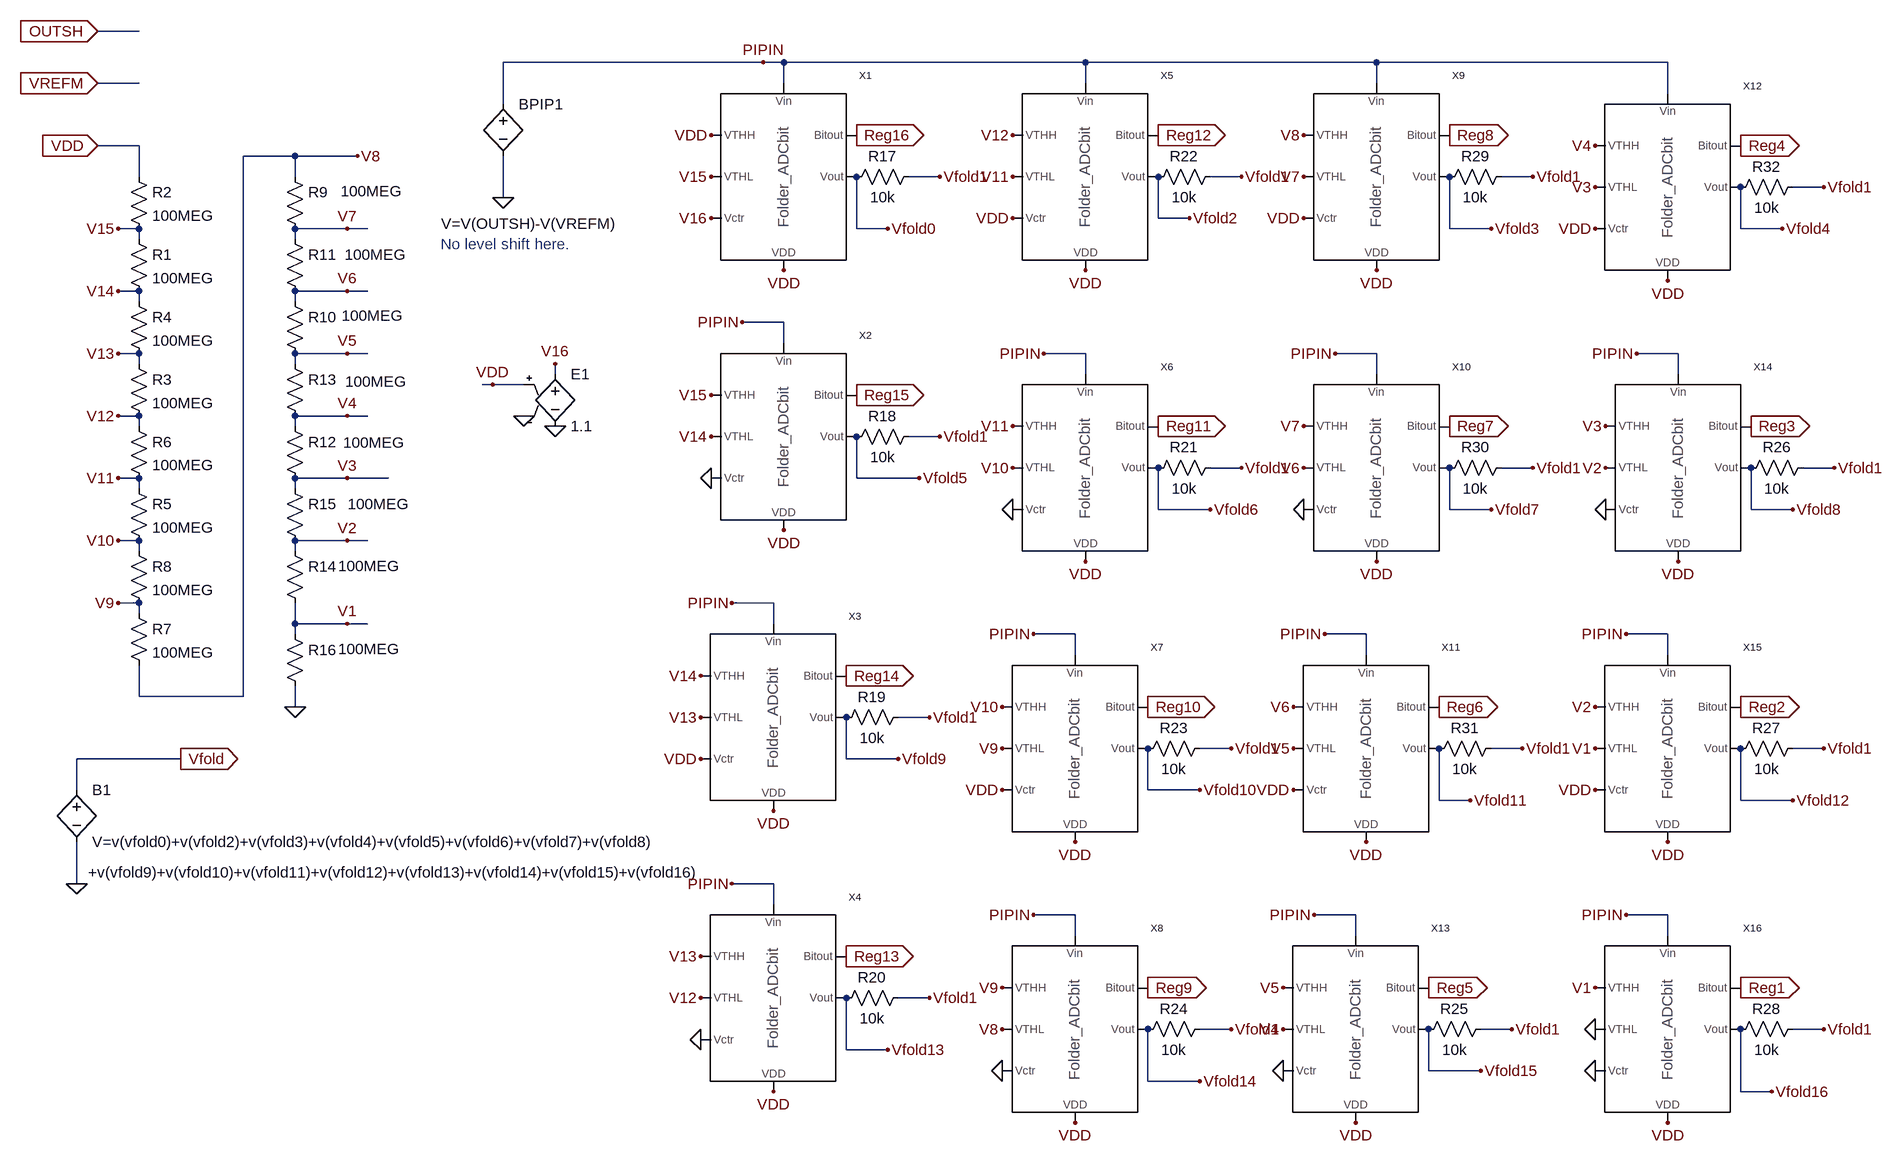
[diagram p0: schematic 4bit_folder.asc]
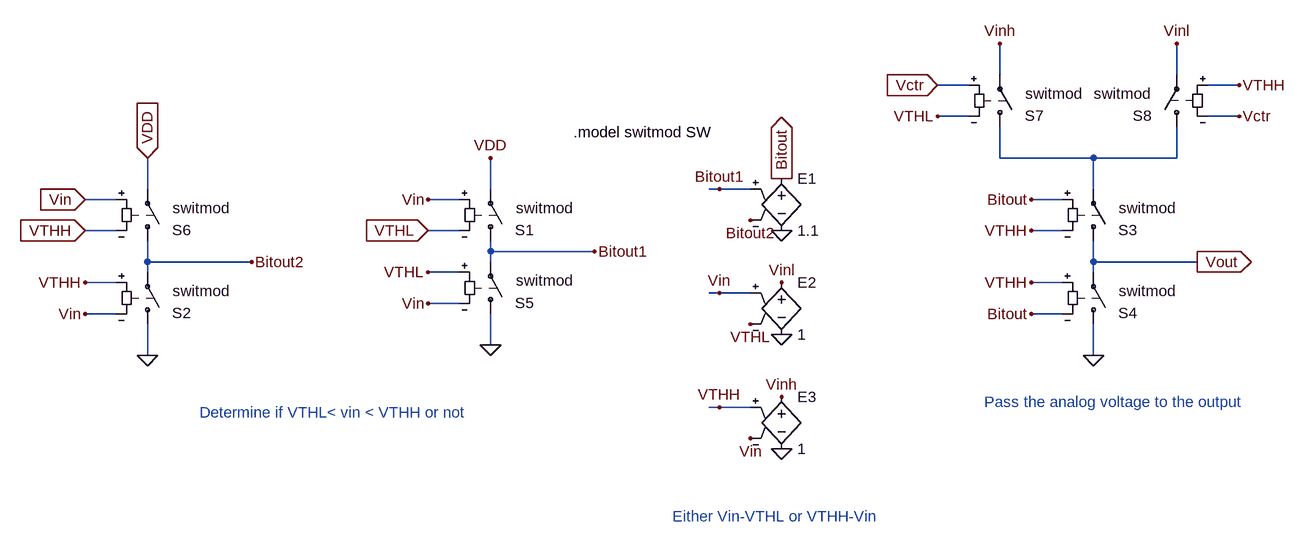
[diagram p1: sub-circuit folder_adcbit.asc]
4bit_folder.asc, the LTspice schematic file:
Version 4
SHEET 1 880 680
WIRE -2192 -1504 -2256 -1504
WIRE -1232 -1456 -1632 -1456
WIRE -1200 -1456 -1232 -1456
WIRE -736 -1456 -1200 -1456
WIRE -288 -1456 -736 -1456
WIRE 160 -1456 -288 -1456
WIRE -2192 -1424 -2256 -1424
WIRE -1200 -1424 -1200 -1456
WIRE -736 -1424 -736 -1456
WIRE -288 -1424 -288 -1456
WIRE 160 -1408 160 -1456
WIRE -1632 -1392 -1632 -1456
WIRE -2192 -1328 -2256 -1328
WIRE -1952 -1312 -2032 -1312
WIRE -1856 -1312 -1952 -1312
WIRE -2192 -1280 -2192 -1328
WIRE -1952 -1280 -1952 -1312
WIRE -960 -1280 -1008 -1280
WIRE -496 -1280 -544 -1280
WIRE -48 -1280 -96 -1280
WIRE 400 -1264 352 -1264
WIRE -1632 -1248 -1632 -1312
WIRE -624 -1216 -624 -1280
WIRE -576 -1216 -624 -1216
WIRE -2192 -1200 -2224 -1200
WIRE -1872 -1200 -1952 -1200
WIRE -1840 -1200 -1872 -1200
WIRE -1088 -1200 -1088 -1280
WIRE -1040 -1200 -1088 -1200
WIRE -176 -1200 -176 -1280
WIRE -112 -1200 -176 -1200
WIRE 272 -1200 272 -1264
WIRE 336 -1200 272 -1200
WIRE -2192 -1184 -2192 -1200
WIRE -1952 -1184 -1952 -1200
WIRE -2192 -1104 -2224 -1104
WIRE -1872 -1104 -1952 -1104
WIRE -1840 -1104 -1872 -1104
WIRE -2192 -1088 -2192 -1104
WIRE -1952 -1088 -1952 -1104
WIRE -1200 -1056 -1264 -1056
WIRE -1200 -1024 -1200 -1056
WIRE -2192 -1008 -2224 -1008
WIRE -1872 -1008 -1952 -1008
WIRE -1840 -1008 -1872 -1008
WIRE -736 -1008 -800 -1008
WIRE -288 -1008 -352 -1008
WIRE 176 -1008 112 -1008
WIRE -2192 -992 -2192 -1008
WIRE -1952 -992 -1952 -1008
WIRE -1552 -976 -1552 -992
WIRE -736 -976 -736 -1008
WIRE -288 -976 -288 -1008
WIRE 176 -976 176 -1008
WIRE -1648 -960 -1664 -960
WIRE -1600 -960 -1648 -960
WIRE -2192 -912 -2224 -912
WIRE -1872 -912 -1952 -912
WIRE -1840 -912 -1872 -912
WIRE -2192 -896 -2192 -912
WIRE -1952 -896 -1952 -912
WIRE -960 -880 -1008 -880
WIRE -496 -832 -544 -832
WIRE -48 -832 -96 -832
WIRE 416 -832 368 -832
WIRE -2192 -816 -2224 -816
WIRE -1872 -816 -1952 -816
WIRE -1808 -816 -1872 -816
WIRE -1088 -816 -1088 -880
WIRE -992 -816 -1088 -816
WIRE -2192 -800 -2192 -816
WIRE -1952 -800 -1952 -816
WIRE -624 -768 -624 -832
WIRE -544 -768 -624 -768
WIRE -176 -768 -176 -832
WIRE -112 -768 -176 -768
WIRE 288 -768 288 -832
WIRE 352 -768 288 -768
WIRE -2192 -720 -2224 -720
WIRE -1872 -720 -1952 -720
WIRE -1840 -720 -1872 -720
WIRE -2192 -704 -2192 -720
WIRE -1952 -704 -1952 -720
WIRE -2192 -624 -2224 -624
WIRE -1216 -624 -1280 -624
WIRE -2192 -608 -2192 -624
WIRE -1952 -592 -1952 -624
WIRE -1872 -592 -1952 -592
WIRE -1840 -592 -1872 -592
WIRE -1216 -592 -1216 -624
WIRE -1952 -576 -1952 -592
WIRE -752 -576 -816 -576
WIRE -304 -576 -368 -576
WIRE 160 -576 96 -576
WIRE -752 -544 -752 -576
WIRE -304 -544 -304 -576
WIRE 160 -544 160 -576
WIRE -2192 -480 -2192 -528
WIRE -2032 -480 -2032 -1312
WIRE -2032 -480 -2192 -480
WIRE -1952 -464 -1952 -496
WIRE -976 -448 -1024 -448
WIRE -512 -400 -560 -400
WIRE -64 -400 -112 -400
WIRE 400 -400 352 -400
WIRE -2128 -384 -2288 -384
WIRE -1104 -384 -1104 -448
WIRE -1024 -384 -1104 -384
WIRE -2288 -336 -2288 -384
WIRE -640 -336 -640 -400
WIRE -560 -336 -640 -336
WIRE -192 -320 -192 -400
WIRE -144 -320 -192 -320
WIRE 272 -320 272 -400
WIRE 352 -320 272 -320
WIRE -2288 -192 -2288 -256
WIRE -1216 -192 -1280 -192
WIRE -1216 -160 -1216 -192
WIRE -752 -144 -816 -144
WIRE -320 -144 -384 -144
WIRE 160 -144 96 -144
WIRE -752 -112 -752 -144
WIRE -320 -112 -320 -144
WIRE 160 -112 160 -144
WIRE -976 -16 -1024 -16
WIRE -512 32 -560 32
WIRE -80 32 -128 32
WIRE 400 32 352 32
WIRE -1104 64 -1104 -16
WIRE -1040 64 -1104 64
WIRE -208 96 -208 32
WIRE -128 96 -208 96
WIRE -640 112 -640 32
WIRE -560 112 -640 112
WIRE 272 128 272 32
WIRE 320 128 272 128
FLAG -1856 -1312 V8
FLAG -1952 -464 0
FLAG -2256 -1328 VDD
IOPIN -2256 -1328 In
FLAG -1632 -1248 0
FLAG -1312 -1280 V15
FLAG -1312 -1344 VDD
FLAG -1232 -1456 PIPIN
FLAG -1872 -1200 V7
FLAG -1872 -1104 V6
FLAG -1872 -1008 V5
FLAG -1872 -912 V4
FLAG -1872 -816 V3
FLAG -1872 -720 V2
FLAG -2224 -1200 V15
FLAG -2224 -1104 V14
FLAG -2224 -1008 V13
FLAG -2224 -912 V12
FLAG -2224 -816 V11
FLAG -2224 -720 V10
FLAG -2224 -624 V9
FLAG -1872 -592 V1
FLAG -1200 -1136 VDD
FLAG -1312 -880 V14
FLAG -1312 -944 V15
FLAG -1264 -1056 PIPIN
FLAG -1200 -736 VDD
FLAG -1328 -448 V13
FLAG -1328 -512 V14
FLAG -1280 -624 PIPIN
FLAG -1216 -304 VDD
FLAG -1328 -16 V12
FLAG -1328 -80 V13
FLAG -1280 -192 PIPIN
FLAG -1216 128 VDD
FLAG -848 -1280 V11
FLAG -848 -1344 V12
FLAG -736 -1136 VDD
FLAG -848 -832 V10
FLAG -848 -896 V11
FLAG -800 -1008 PIPIN
FLAG -736 -688 VDD
FLAG -864 -400 V9
FLAG -864 -464 V10
FLAG -816 -576 PIPIN
FLAG -752 -256 VDD
FLAG -864 32 V8
FLAG -864 -32 V9
FLAG -816 -144 PIPIN
FLAG -752 176 VDD
FLAG -400 -1280 V7
FLAG -400 -1344 V8
FLAG -288 -1136 VDD
FLAG -400 -832 V6
FLAG -400 -896 V7
FLAG -352 -1008 PIPIN
FLAG -288 -688 VDD
FLAG -416 -400 V5
FLAG -416 -464 V6
FLAG -368 -576 PIPIN
FLAG -304 -256 VDD
FLAG 48 -1264 V3
FLAG 48 -1328 V4
FLAG -384 -144 PIPIN
FLAG 160 -1120 VDD
FLAG -432 32 V4
FLAG -432 -32 V5
FLAG -960 -1280 Vfold1
FLAG -320 176 VDD
FLAG 64 -832 V2
FLAG 64 -896 V3
FLAG 112 -1008 PIPIN
FLAG 176 -688 VDD
FLAG 48 -400 V1
FLAG 48 -464 V2
FLAG 96 -576 PIPIN
FLAG 160 -256 VDD
FLAG 48 32 0
FLAG 48 -32 V1
FLAG 96 -144 PIPIN
FLAG 160 176 VDD
FLAG -496 -1280 Vfold1
FLAG -432 96 0
FLAG -864 96 0
FLAG -1328 48 0
FLAG -416 -336 VDD
FLAG 48 -336 VDD
FLAG -864 -336 VDD
FLAG -1328 -384 VDD
FLAG -848 -1216 VDD
FLAG -400 -1216 VDD
FLAG 48 -1200 VDD
FLAG 48 96 0
FLAG 64 -768 0
FLAG -400 -768 0
FLAG -848 -768 0
FLAG -1312 -816 0
FLAG -1312 -1216 V16
FLAG -1552 -896 0
FLAG -1552 -992 V16
FLAG -1600 -912 0
FLAG -1648 -960 VDD
FLAG -48 -1280 Vfold1
FLAG 400 -1264 Vfold1
FLAG 416 -832 Vfold1
FLAG 400 -400 Vfold1
FLAG 400 32 Vfold1
FLAG -80 32 Vfold1
FLAG -64 -400 Vfold1
FLAG -48 -832 Vfold1
FLAG -496 -832 Vfold1
FLAG -512 -400 Vfold1
FLAG -512 32 Vfold1
FLAG -976 -16 Vfold1
FLAG -976 -448 Vfold1
FLAG -960 -880 Vfold1
FLAG -2256 -1424 VREFM
IOPIN -2256 -1424 In
FLAG -2256 -1504 OUTSH
IOPIN -2256 -1504 In
FLAG -1088 -1344 Reg16
IOPIN -1088 -1344 Out
FLAG -1088 -944 Reg15
IOPIN -1088 -944 Out
FLAG -1104 -512 Reg14
IOPIN -1104 -512 Out
FLAG -1104 -80 Reg13
IOPIN -1104 -80 Out
FLAG -624 -1344 Reg12
IOPIN -624 -1344 Out
FLAG -624 -896 Reg11
IOPIN -624 -896 Out
FLAG -640 -464 Reg10
IOPIN -640 -464 Out
FLAG -640 -32 Reg9
IOPIN -640 -32 Out
FLAG -176 -1344 Reg8
IOPIN -176 -1344 Out
FLAG -176 -896 Reg7
IOPIN -176 -896 Out
FLAG -192 -464 Reg6
IOPIN -192 -464 Out
FLAG -208 -32 Reg5
IOPIN -208 -32 Out
FLAG 272 -1328 Reg4
IOPIN 272 -1328 Out
FLAG 288 -896 Reg3
IOPIN 288 -896 Out
FLAG 272 -464 Reg2
IOPIN 272 -464 Out
FLAG 272 -32 Reg1
IOPIN 272 -32 Out
FLAG -1040 -1200 Vfold0
FLAG -992 -816 Vfold5
FLAG -1024 -384 Vfold9
FLAG -1040 64 Vfold13
FLAG -560 112 Vfold14
FLAG -560 -336 Vfold10
FLAG -544 -768 Vfold6
FLAG -576 -1216 Vfold2
FLAG -112 -1200 Vfold3
FLAG -112 -768 Vfold7
FLAG -144 -320 Vfold11
FLAG -128 96 Vfold15
FLAG 320 128 Vfold16
FLAG 352 -320 Vfold12
FLAG 352 -768 Vfold8
FLAG 336 -1200 Vfold4
FLAG -2288 -192 0
FLAG -2128 -384 Vfold
IOPIN -2128 -384 Out
SYMBOL res -2208 -1200 R0
SYMATTR InstName R1
SYMATTR Value 100MEG
SYMBOL res -2208 -1296 R0
SYMATTR InstName R2
SYMATTR Value 100MEG
SYMBOL bv -1632 -1408 R0
WINDOW 3 -95 200 Left 0
SYMATTR Value V=V(OUTSH)-V(VREFM)
SYMATTR InstName BPIP1
SYMBOL res -2208 -1008 R0
SYMATTR InstName R3
SYMATTR Value 100MEG
SYMBOL res -2208 -1104 R0
SYMATTR InstName R4
SYMATTR Value 100MEG
SYMBOL res -2208 -816 R0
SYMATTR InstName R5
SYMATTR Value 100MEG
SYMBOL res -2208 -912 R0
SYMATTR InstName R6
SYMATTR Value 100MEG
SYMBOL res -2208 -624 R0
SYMATTR InstName R7
SYMATTR Value 100MEG
SYMBOL res -2208 -720 R0
SYMATTR InstName R8
SYMATTR Value 100MEG
SYMBOL res -1968 -1296 R0
WINDOW 3 86 38 Left 0
SYMATTR Value 100MEG
SYMATTR InstName R9
SYMBOL res -1968 -1104 R0
WINDOW 3 88 38 Left 0
SYMATTR Value 100MEG
SYMATTR InstName R10
SYMBOL res -1968 -1200 R0
WINDOW 3 92 40 Left 0
SYMATTR Value 100MEG
SYMATTR InstName R11
SYMBOL res -1968 -912 R0
WINDOW 3 90 41 Left 0
SYMATTR Value 100MEG
SYMATTR InstName R12
SYMBOL res -1968 -1008 R0
WINDOW 3 93 43 Left 0
SYMATTR Value 100MEG
SYMATTR InstName R13
SYMBOL res -1968 -720 R0
WINDOW 3 82 39 Left 0
SYMATTR Value 100MEG
SYMATTR InstName R14
SYMBOL res -1968 -816 R0
WINDOW 3 97 40 Left 0
SYMATTR Value 100MEG
SYMATTR InstName R15
SYMBOL res -1968 -592 R0
WINDOW 3 82 39 Left 0
SYMATTR Value 100MEG
SYMATTR InstName R16
SYMBOL Folder_ADCbit -1344 -1312 R0
SYMATTR InstName X1
SYMBOL Folder_ADCbit -1344 -912 R0
SYMATTR InstName X2
SYMBOL Folder_ADCbit -1360 -480 R0
SYMATTR InstName X3
SYMBOL Folder_ADCbit -1360 -48 R0
SYMATTR InstName X4
SYMBOL Folder_ADCbit -880 -1312 R0
SYMATTR InstName X5
SYMBOL Folder_ADCbit -880 -864 R0
SYMATTR InstName X6
SYMBOL Folder_ADCbit -896 -432 R0
SYMATTR InstName X7
SYMBOL Folder_ADCbit -896 0 R0
SYMATTR InstName X8
SYMBOL Folder_ADCbit -432 -1312 R0
SYMATTR InstName X9
SYMBOL Folder_ADCbit -432 -864 R0
SYMATTR InstName X10
SYMBOL Folder_ADCbit -448 -432 R0
SYMATTR InstName X11
SYMBOL Folder_ADCbit 16 -1296 R0
SYMATTR InstName X12
SYMBOL Folder_ADCbit -464 0 R0
SYMATTR InstName X13
SYMBOL Folder_ADCbit 32 -864 R0
SYMATTR InstName X14
SYMBOL Folder_ADCbit 16 -432 R0
SYMATTR InstName X15
SYMBOL Folder_ADCbit 16 0 R0
SYMATTR InstName X16
SYMBOL res -992 -1296 R90
WINDOW 0 0 56 VBottom 0
WINDOW 3 32 56 VTop 0
SYMATTR InstName R17
SYMATTR Value 10k
SYMBOL res -992 -896 R90
WINDOW 0 0 56 VBottom 0
WINDOW 3 32 56 VTop 0
SYMATTR InstName R18
SYMATTR Value 10k
SYMBOL res -1008 -464 R90
WINDOW 0 0 56 VBottom 0
WINDOW 3 32 56 VTop 0
SYMATTR InstName R19
SYMATTR Value 10k
SYMBOL res -1008 -32 R90
WINDOW 0 0 56 VBottom 0
WINDOW 3 32 56 VTop 0
SYMATTR InstName R20
SYMATTR Value 10k
SYMBOL res -528 -848 R90
WINDOW 0 0 56 VBottom 0
WINDOW 3 32 56 VTop 0
SYMATTR InstName R21
SYMATTR Value 10k
SYMBOL res -528 -1296 R90
WINDOW 0 0 56 VBottom 0
WINDOW 3 32 56 VTop 0
SYMATTR InstName R22
SYMATTR Value 10k
SYMBOL res -544 -416 R90
WINDOW 0 0 56 VBottom 0
WINDOW 3 32 56 VTop 0
SYMATTR InstName R23
SYMATTR Value 10k
SYMBOL res -544 16 R90
WINDOW 0 0 56 VBottom 0
WINDOW 3 32 56 VTop 0
SYMATTR InstName R24
SYMATTR Value 10k
SYMBOL res -112 16 R90
WINDOW 0 0 56 VBottom 0
WINDOW 3 32 56 VTop 0
SYMATTR InstName R25
SYMATTR Value 10k
SYMBOL res 384 -848 R90
WINDOW 0 0 56 VBottom 0
WINDOW 3 32 56 VTop 0
SYMATTR InstName R26
SYMATTR Value 10k
SYMBOL res 368 -416 R90
WINDOW 0 0 56 VBottom 0
WINDOW 3 32 56 VTop 0
SYMATTR InstName R27
SYMATTR Value 10k
SYMBOL res 368 16 R90
WINDOW 0 0 56 VBottom 0
WINDOW 3 32 56 VTop 0
SYMATTR InstName R28
SYMATTR Value 10k
SYMBOL res -80 -1296 R90
WINDOW 0 0 56 VBottom 0
WINDOW 3 32 56 VTop 0
SYMATTR InstName R29
SYMATTR Value 10k
SYMBOL res -80 -848 R90
WINDOW 0 0 56 VBottom 0
WINDOW 3 32 56 VTop 0
SYMATTR InstName R30
SYMATTR Value 10k
SYMBOL res -96 -416 R90
WINDOW 0 0 56 VBottom 0
WINDOW 3 32 56 VTop 0
SYMATTR InstName R31
SYMATTR Value 10k
SYMBOL res 368 -1280 R90
WINDOW 0 0 56 VBottom 0
WINDOW 3 32 56 VTop 0
SYMATTR InstName R32
SYMATTR Value 10k
SYMBOL e -1552 -992 R0
SYMATTR InstName E1
SYMATTR Value 1.1
SYMBOL bv -2288 -352 R0
WINDOW 123 18 143 Left 0
SYMATTR Value2 +v(vfold9)+v(vfold10)+v(vfold11)+v(vfold12)+v(vfold13)+v(vfold14)+v(vfold15)+v(vfold16)
SYMATTR InstName B1
SYMATTR Value V=v(vfold0)+v(vfold2)+v(vfold3)+v(vfold4)+v(vfold5)+v(vfold6)+v(vfold7)+v(vfold8)
TEXT -1728 -1176 Left 0 ;No level shift here.

folder_adcbit.asc, the sub-circuit schematic file:
Version 4
SHEET 1 880 680
WIRE 32 -224 32 -272
WIRE 304 -224 304 -272
WIRE -16 -208 -64 -208
WIRE 400 -208 352 -208
WIRE -16 -160 -64 -160
WIRE 400 -160 352 -160
WIRE 32 -96 32 -144
WIRE 176 -96 32 -96
WIRE 304 -96 304 -144
WIRE 304 -96 176 -96
WIRE -1280 -48 -1280 -96
WIRE -752 -48 -752 -96
WIRE -400 -48 -416 -48
WIRE -352 -48 -400 -48
WIRE 176 -48 176 -96
WIRE -1328 -32 -1376 -32
WIRE -800 -32 -848 -32
WIRE 128 -32 80 -32
WIRE -1328 16 -1376 16
WIRE -800 16 -848 16
WIRE 128 16 80 16
WIRE -752 48 -752 32
WIRE -592 48 -752 48
WIRE -1280 64 -1280 32
WIRE -1120 64 -1280 64
WIRE -752 64 -752 48
WIRE 176 64 176 32
WIRE 336 64 176 64
WIRE -1280 80 -1280 64
WIRE -800 80 -848 80
WIRE 176 80 176 64
WIRE -1328 96 -1376 96
WIRE 128 96 80 96
WIRE -400 112 -416 112
WIRE -352 112 -400 112
WIRE -800 128 -848 128
WIRE -1328 144 -1376 144
WIRE 128 144 80 144
WIRE -752 192 -752 144
WIRE -1280 208 -1280 160
WIRE 176 208 176 160
WIRE -400 288 -416 288
WIRE -352 288 -400 288
FLAG -848 -32 Vin
FLAG -848 16 VTHL
IOPIN -848 16 In
FLAG -1376 96 VTHH
FLAG -1376 144 Vin
FLAG -1120 64 Bitout2
FLAG -1280 208 0
FLAG -752 -96 VDD
FLAG 80 -32 Bitout
FLAG 80 16 VTHH
FLAG 80 96 VTHH
FLAG 80 144 Bitout
FLAG 336 64 Vout
IOPIN 336 64 Out
FLAG -304 16 0
FLAG -304 176 0
FLAG -304 -64 Bitout
IOPIN -304 -64 Out
FLAG -304 96 Vinl
FLAG -352 160 VTHL
FLAG -352 0 Bitout2
FLAG -400 -48 Bitout1
FLAG -400 112 Vin
FLAG -848 80 VTHL
FLAG -848 128 Vin
FLAG -592 48 Bitout1
FLAG -752 192 0
FLAG -1376 -32 Vin
IOPIN -1376 -32 In
FLAG -1376 16 VTHH
IOPIN -1376 16 In
FLAG -1280 -96 VDD
IOPIN -1280 -96 In
FLAG 176 208 0
FLAG -304 352 0
FLAG -304 272 Vinh
FLAG -352 336 Vin
FLAG -400 288 VTHH
FLAG -64 -208 Vctr
IOPIN -64 -208 In
FLAG -64 -160 VTHL
FLAG 32 -272 Vinh
FLAG 400 -208 VTHH
FLAG 400 -160 Vctr
FLAG 304 -272 Vinl
SYMBOL sw -752 48 M180
WINDOW 3 24 -12 Left 0
WINDOW 38 39 67 Left 0
WINDOW 0 38 33 Left 0
SYMATTR Value ""
SYMATTR SpiceModel switmod
SYMATTR InstName S1
SYMBOL sw -1280 176 M180
WINDOW 3 24 -12 Left 0
WINDOW 38 39 67 Left 0
WINDOW 0 38 33 Left 0
SYMATTR Value ""
SYMATTR SpiceModel switmod
SYMATTR InstName S2
SYMBOL sw 176 48 M180
WINDOW 3 24 -12 Left 0
WINDOW 38 39 67 Left 0
WINDOW 0 38 33 Left 0
SYMATTR Value ""
SYMATTR SpiceModel switmod
SYMATTR InstName S3
SYMBOL sw 176 176 M180
WINDOW 3 24 -12 Left 0
WINDOW 38 39 67 Left 0
WINDOW 0 38 33 Left 0
SYMATTR Value ""
SYMATTR SpiceModel switmod
SYMATTR InstName S4
SYMBOL e -304 -80 R0
SYMATTR InstName E1
SYMATTR Value 1.1
SYMBOL e -304 80 R0
SYMATTR InstName E2
SYMATTR Value 1
SYMBOL sw -752 160 M180
WINDOW 3 24 -12 Left 0
WINDOW 38 39 67 Left 0
WINDOW 0 38 33 Left 0
SYMATTR Value ""
SYMATTR SpiceModel switmod
SYMATTR InstName S5
SYMBOL sw -1280 48 M180
WINDOW 3 24 -12 Left 0
WINDOW 38 39 67 Left 0
WINDOW 0 38 33 Left 0
SYMATTR Value ""
SYMATTR SpiceModel switmod
SYMATTR InstName S6
SYMBOL e -304 256 R0
SYMATTR InstName E3
SYMATTR Value 1
SYMBOL sw 32 -128 M180
WINDOW 3 24 -12 Left 0
WINDOW 38 39 67 Left 0
WINDOW 0 38 33 Left 0
SYMATTR Value ""
SYMATTR SpiceModel switmod
SYMATTR InstName S7
SYMBOL sw 304 -128 R180
WINDOW 3 24 -12 Left 0
WINDOW 38 39 67 Left 0
WINDOW 0 38 33 Left 0
SYMATTR Value ""
SYMATTR SpiceModel switmod
SYMATTR InstName S8
TEXT -1200 296 Left 0 ;Determine if VTHL< vin < VTHH or not
TEXT -472 456 Left 0 ;Either Vin-VTHL or VTHH-Vin
TEXT 8 280 Left 0 ;Pass the analog voltage to the output
TEXT -624 -136 Left 0 !.model switmod SW

The netlist it stands for:
* 4bit_folder.asc
R1 V15 V14 100MEG
R2 VDD V15 100MEG
BPIP1 PIPIN 0 V=V(OUTSH)-V(VREFM)
R3 V13 V12 100MEG
R4 V14 V13 100MEG
R5 V11 V10 100MEG
R6 V12 V11 100MEG
R7 V9 V8 100MEG
R8 V10 V9 100MEG
R9 V8 V7 100MEG
R10 V6 V5 100MEG
R11 V7 V6 100MEG
R12 V4 V3 100MEG
R13 V5 V4 100MEG
R14 V2 V1 100MEG
R15 V3 V2 100MEG
R16 V1 0 100MEG
XX1 VDD V15 V16 PIPIN Vfold0 VDD Reg16 folder_adcbit
XX2 V15 V14 0 PIPIN Vfold5 VDD Reg15 folder_adcbit
XX3 V14 V13 VDD PIPIN Vfold9 VDD Reg14 folder_adcbit
XX4 V13 V12 0 PIPIN Vfold13 VDD Reg13 folder_adcbit
XX5 V12 V11 VDD PIPIN Vfold2 VDD Reg12 folder_adcbit
XX6 V11 V10 0 PIPIN Vfold6 VDD Reg11 folder_adcbit
XX7 V10 V9 VDD PIPIN Vfold10 VDD Reg10 folder_adcbit
XX8 V9 V8 0 PIPIN Vfold14 VDD Reg9 folder_adcbit
XX9 V8 V7 VDD PIPIN Vfold3 VDD Reg8 folder_adcbit
XX10 V7 V6 0 PIPIN Vfold7 VDD Reg7 folder_adcbit
XX11 V6 V5 VDD PIPIN Vfold11 VDD Reg6 folder_adcbit
XX12 V4 V3 VDD PIPIN Vfold4 VDD Reg4 folder_adcbit
XX13 V5 V4 0 PIPIN Vfold15 VDD Reg5 folder_adcbit
XX14 V3 V2 0 PIPIN Vfold8 VDD Reg3 folder_adcbit
XX15 V2 V1 VDD PIPIN Vfold12 VDD Reg2 folder_adcbit
XX16 V1 0 0 PIPIN Vfold16 VDD Reg1 folder_adcbit
R17 Vfold1 Vfold0 10k
R18 Vfold1 Vfold5 10k
R19 Vfold1 Vfold9 10k
R20 Vfold1 Vfold13 10k
R21 Vfold1 Vfold6 10k
R22 Vfold1 Vfold2 10k
R23 Vfold1 Vfold10 10k
R24 Vfold1 Vfold14 10k
R25 Vfold1 Vfold15 10k
R26 Vfold1 Vfold8 10k
R27 Vfold1 Vfold12 10k
R28 Vfold1 Vfold16 10k
R29 Vfold1 Vfold3 10k
R30 Vfold1 Vfold7 10k
R31 Vfold1 Vfold11 10k
R32 Vfold1 Vfold4 10k
E1 V16 0 VDD 0 1.1
B1 Vfold 0 V=v(vfold0)+v(vfold2)+v(vfold3)+v(vfold4)+v(vfold5)+v(vfold6)+v(vfold7)+v(vfold8) +v(vfold9)+v(vfold10)+v(vfold11)+v(vfold12)+v(vfold13)+v(vfold14)+v(vfold15)+v(vfold16)

* block symbol definitions
.subckt folder_adcbit VTHH VTHL Vctr Vin Vout VDD Bitout
S1 Bitout1 VDD Vin VTHL switmod
S2 0 Bitout2 VTHH Vin switmod
S3 Vout N001 Bitout VTHH switmod
S4 0 Vout VTHH Bitout switmod
E1 Bitout 0 Bitout1 Bitout2 1.1
E2 Vinl 0 Vin VTHL 1
S5 0 Bitout1 VTHL Vin switmod
S6 Bitout2 VDD Vin VTHH switmod
E3 Vinh 0 VTHH Vin 1
S7 N001 Vinh Vctr VTHL switmod
S8 N001 Vinl VTHH Vctr switmod
* Determine if VTHL< vin < VTHH or not
* Either Vin-VTHL or VTHH-Vin
* Pass the analog voltage to the output
.model switmod SW
.ends folder_adcbit

* No level shift here.
.backanno
.end